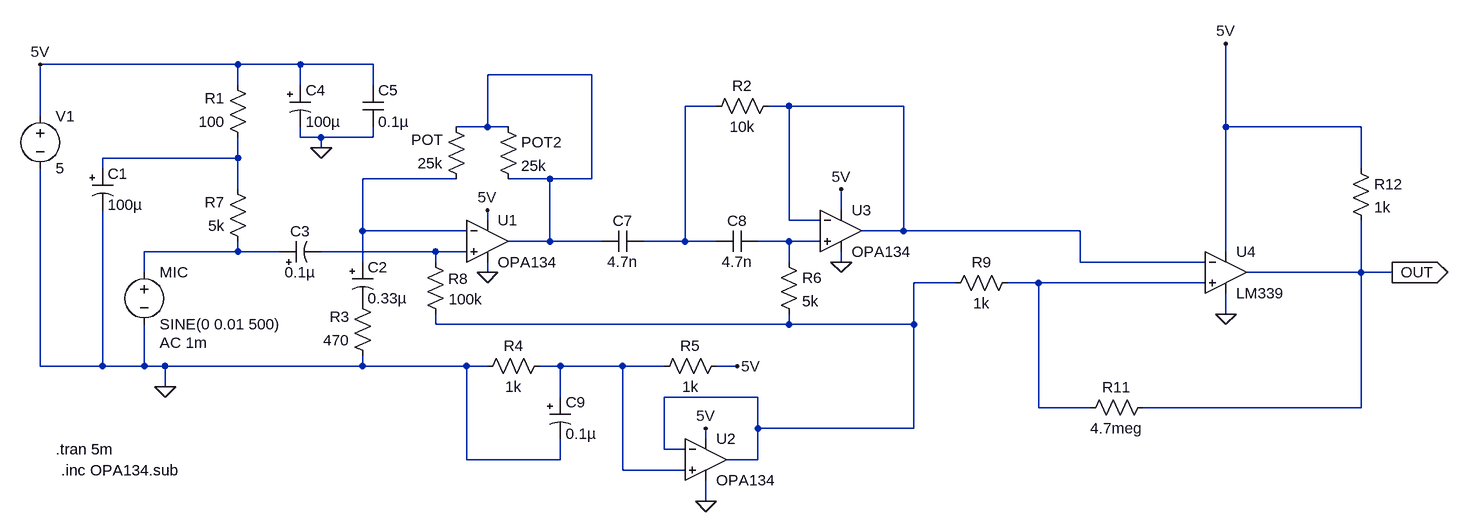
[diagram p0: schematic UltrasonicAmp.asc]
UltrasonicAmp.asc, the LTspice schematic file:
Version 4
SHEET 1 1316 964
WIRE -57600 -7728 -57904 -7728
WIRE -57504 -7728 -57600 -7728
WIRE -57392 -7728 -57504 -7728
WIRE -57056 -7712 -57216 -7712
WIRE -57600 -7696 -57600 -7728
WIRE -57504 -7696 -57504 -7728
WIRE -57392 -7696 -57392 -7728
WIRE -56864 -7664 -56912 -7664
WIRE -56752 -7664 -56784 -7664
WIRE -56576 -7664 -56752 -7664
WIRE -57904 -7648 -57904 -7728
WIRE -57216 -7632 -57216 -7712
WIRE -57216 -7632 -57264 -7632
WIRE -57184 -7632 -57216 -7632
WIRE -56080 -7632 -56080 -7760
WIRE -55872 -7632 -56080 -7632
WIRE -57504 -7616 -57504 -7632
WIRE -57472 -7616 -57504 -7616
WIRE -57392 -7616 -57392 -7632
WIRE -57392 -7616 -57472 -7616
WIRE -57472 -7600 -57472 -7616
WIRE -57600 -7584 -57600 -7616
WIRE -57600 -7584 -57808 -7584
WIRE -57808 -7568 -57808 -7584
WIRE -55872 -7568 -55872 -7632
WIRE -57264 -7552 -57408 -7552
WIRE -57120 -7552 -57184 -7552
WIRE -57056 -7552 -57056 -7712
WIRE -57056 -7552 -57120 -7552
WIRE -57600 -7536 -57600 -7584
WIRE -56672 -7504 -56672 -7536
WIRE -57216 -7488 -57216 -7504
WIRE -56752 -7488 -56752 -7664
WIRE -56704 -7488 -56752 -7488
WIRE -57408 -7472 -57408 -7552
WIRE -57248 -7472 -57408 -7472
WIRE -56576 -7472 -56576 -7664
WIRE -56576 -7472 -56640 -7472
WIRE -56304 -7472 -56576 -7472
WIRE -57120 -7456 -57120 -7552
WIRE -57120 -7456 -57184 -7456
WIRE -57040 -7456 -57120 -7456
WIRE -56912 -7456 -56912 -7664
WIRE -56912 -7456 -56976 -7456
WIRE -56864 -7456 -56912 -7456
WIRE -56752 -7456 -56800 -7456
WIRE -56704 -7456 -56752 -7456
WIRE -57600 -7440 -57600 -7456
WIRE -57600 -7440 -57744 -7440
WIRE -57536 -7440 -57600 -7440
WIRE -57296 -7440 -57472 -7440
WIRE -57248 -7440 -57296 -7440
WIRE -56080 -7440 -56080 -7632
WIRE -57408 -7424 -57408 -7472
WIRE -57296 -7424 -57296 -7440
WIRE -56752 -7424 -56752 -7456
WIRE -56672 -7424 -56672 -7440
WIRE -56304 -7424 -56304 -7472
WIRE -56112 -7424 -56304 -7424
WIRE -57744 -7408 -57744 -7440
WIRE -57216 -7408 -57216 -7424
WIRE -55872 -7408 -55872 -7488
WIRE -55872 -7408 -56048 -7408
WIRE -55824 -7408 -55872 -7408
WIRE -56496 -7392 -56560 -7392
WIRE -56368 -7392 -56416 -7392
WIRE -56112 -7392 -56368 -7392
WIRE -56080 -7344 -56080 -7376
WIRE -57296 -7328 -57296 -7344
WIRE -56752 -7328 -56752 -7344
WIRE -56752 -7328 -57296 -7328
WIRE -56560 -7328 -56560 -7392
WIRE -56560 -7328 -56752 -7328
WIRE -57904 -7264 -57904 -7568
WIRE -57808 -7264 -57808 -7504
WIRE -57808 -7264 -57904 -7264
WIRE -57744 -7264 -57744 -7328
WIRE -57744 -7264 -57808 -7264
WIRE -57712 -7264 -57744 -7264
WIRE -57408 -7264 -57408 -7280
WIRE -57408 -7264 -57712 -7264
WIRE -57248 -7264 -57408 -7264
WIRE -57216 -7264 -57248 -7264
WIRE -57104 -7264 -57136 -7264
WIRE -57008 -7264 -57104 -7264
WIRE -56944 -7264 -57008 -7264
WIRE -56832 -7264 -56864 -7264
WIRE -57712 -7232 -57712 -7264
WIRE -57104 -7216 -57104 -7264
WIRE -56800 -7216 -56944 -7216
WIRE -56368 -7200 -56368 -7392
WIRE -56288 -7200 -56368 -7200
WIRE -55872 -7200 -55872 -7408
WIRE -55872 -7200 -56208 -7200
WIRE -56800 -7168 -56800 -7216
WIRE -56560 -7168 -56560 -7328
WIRE -56560 -7168 -56800 -7168
WIRE -56880 -7152 -56880 -7168
WIRE -56944 -7136 -56944 -7216
WIRE -56912 -7136 -56944 -7136
WIRE -57248 -7120 -57248 -7264
WIRE -57104 -7120 -57104 -7152
WIRE -57104 -7120 -57248 -7120
WIRE -56800 -7120 -56800 -7168
WIRE -56800 -7120 -56848 -7120
WIRE -57008 -7104 -57008 -7264
WIRE -56912 -7104 -57008 -7104
WIRE -56880 -7056 -56880 -7088
FLAG -57712 -7232 0
FLAG -57472 -7600 0
FLAG -56080 -7344 0
FLAG -56080 -7760 5V
FLAG -57904 -7728 5V
FLAG -55824 -7408 OUT
IOPIN -55824 -7408 Out
FLAG -56832 -7264 5V
FLAG -56880 -7168 5V
FLAG -56672 -7536 5V
FLAG -56672 -7424 0
FLAG -56880 -7056 0
FLAG -57216 -7408 0
FLAG -57216 -7504 5V
SYMBOL voltage -57904 -7664 R0
WINDOW 123 0 0 Left 2
WINDOW 39 0 0 Left 2
SYMATTR InstName V1
SYMATTR Value 5
SYMBOL voltage -57744 -7424 R0
WINDOW 123 24 124 Left 2
WINDOW 39 0 0 Left 2
SYMATTR Value2 AC 1m
SYMATTR InstName MIC
SYMATTR Value SINE(0 0.01 500)
SYMBOL res -57584 -7600 R180
WINDOW 0 36 76 Left 2
WINDOW 3 36 40 Left 2
SYMATTR InstName R1
SYMATTR Value 100
SYMBOL res -57584 -7440 R180
WINDOW 0 36 76 Left 2
WINDOW 3 36 40 Left 2
SYMATTR InstName R7
SYMATTR Value 5k
SYMBOL res -57280 -7328 R180
WINDOW 0 -34 70 Left 2
WINDOW 3 -57 39 Left 2
SYMATTR InstName R8
SYMATTR Value 100k
SYMBOL res -57392 -7264 R180
WINDOW 0 36 76 Left 2
WINDOW 3 36 40 Left 2
SYMATTR InstName R3
SYMATTR Value 470
SYMBOL res -57232 -7248 R270
WINDOW 0 32 56 VTop 2
WINDOW 3 0 56 VBottom 2
SYMATTR InstName R4
SYMATTR Value 1k
SYMBOL polcap -57520 -7696 R0
WINDOW 3 24 56 Left 2
SYMATTR Value 100µ
SYMATTR InstName C4
SYMATTR Description Capacitor
SYMATTR Type cap
SYMBOL cap -57408 -7696 R0
SYMATTR InstName C5
SYMATTR Value 0.1µ
SYMBOL polcap -57824 -7568 R0
WINDOW 3 24 56 Left 2
SYMATTR Value 100µ
SYMATTR InstName C1
SYMATTR Description Capacitor
SYMATTR Type cap
SYMATTR SpiceLine V=6.3 Irms=175m Rser=0.65 Lser=0 mfg="Panasonic" pn="ECA0JFQ101" type="Al electrolytic"
SYMBOL polcap -57536 -7424 R270
WINDOW 0 32 32 VTop 2
WINDOW 3 0 32 VBottom 2
SYMATTR InstName C3
SYMATTR Value 0.1µ
SYMATTR Description Capacitor
SYMATTR Type cap
SYMBOL polcap -57424 -7424 R0
WINDOW 3 24 56 Left 2
SYMATTR Value 0.33µ
SYMATTR InstName C2
SYMATTR Description Capacitor
SYMATTR Type cap
SYMBOL res -57248 -7536 R180
WINDOW 0 36 76 Left 2
WINDOW 3 36 40 Left 2
SYMATTR InstName POT
SYMATTR Value 25k
SYMBOL cap -56976 -7472 R90
WINDOW 0 0 32 VBottom 2
WINDOW 3 32 32 VTop 2
SYMATTR InstName C7
SYMATTR Value 4.7n
SYMBOL cap -56800 -7472 R90
WINDOW 0 0 32 VBottom 2
WINDOW 3 32 32 VTop 2
SYMATTR InstName C8
SYMATTR Value 4.7n
SYMBOL polcap -57120 -7216 R0
SYMATTR InstName C9
SYMATTR Value 0.1µ
SYMATTR Description Capacitor
SYMATTR Type cap
SYMBOL res -56880 -7648 R270
WINDOW 0 32 56 VTop 2
WINDOW 3 0 56 VBottom 2
SYMATTR InstName R2
SYMATTR Value 10k
SYMBOL res -56960 -7248 R270
WINDOW 0 32 56 VTop 2
WINDOW 3 0 56 VBottom 2
SYMATTR InstName R5
SYMATTR Value 1k
SYMBOL res -56512 -7376 R270
WINDOW 0 32 56 VTop 2
WINDOW 3 0 56 VBottom 2
SYMATTR InstName R9
SYMATTR Value 1k
SYMBOL res -56304 -7184 R270
WINDOW 0 32 56 VTop 2
WINDOW 3 0 56 VBottom 2
SYMATTR InstName R11
SYMATTR Value 4.7meg
SYMBOL res -56768 -7440 R0
SYMATTR InstName R6
SYMATTR Value 5k
SYMBOL Comparators\\LM339 -56080 -7472 R0
SYMATTR InstName U4
SYMBOL res -55888 -7584 R0
SYMATTR InstName R12
SYMATTR Value 1k
SYMBOL Opamps\\opamp2 -57216 -7520 R0
SYMATTR InstName U1
SYMATTR Value OPA134
SYMBOL Opamps\\opamp2 -56880 -7184 R0
SYMATTR InstName U2
SYMATTR Value OPA134
SYMBOL Opamps\\opamp2 -56672 -7536 R0
SYMATTR InstName U3
SYMATTR Value OPA134
SYMBOL res -57200 -7648 R0
SYMATTR InstName POT2
SYMATTR Value 25k
TEXT -57880 -7136 Left 2 !.tran 5m
TEXT -57872 -7104 Left 2 !.inc OPA134.sub

The netlist it stands for:
* UltrasonicAmp.asc
V1 5V 0 5
V§MIC N007 0 SINE(0 0.01 500) AC 1m
R1 N004 5V 100
R7 N007 N004 5k
R8 N009 N008 100k
R3 0 P001 470
R4 0 N011 1k
C4 5V 0 100µ
C5 5V 0 0.1µ
C1 N004 0 100µ V=6.3 Irms=175m Rser=0.65 Lser=0 mfg="Panasonic" pn="ECA0JFQ101" type="Al electrolytic"
C3 N007 N008 0.1µ
C2 N005 P001 0.33µ
R§POT N005 N001 25k
C7 N002 N001 4.7n
C8 N006 N002 4.7n
C9 N011 0 0.1µ
R2 N002 N003 10k
R5 N011 5V 1k
R9 N009 N010 1k
R11 N010 OUT 4.7meg
R6 N006 N009 5k
XU4 N010 N003 5V 0 OUT LM339  ; pins In+ In- V+ V- OUT
R12 5V OUT 1k
XU1 N008 N005 5V 0 N001 OPA134  ; pins In+ In- V+ V- OUT
XU2 N011 N009 5V 0 N009 OPA134  ; pins In+ In- V+ V- OUT
XU3 N006 N003 5V 0 N003 OPA134  ; pins In+ In- V+ V- OUT
R§POT2 N001 N001 25k
.tran 5m
.inc OPA134.sub
.lib LM339.sub
.backanno
.end